# EAGLE design breakout_SX1278_green (EAGLE 8.2.0)
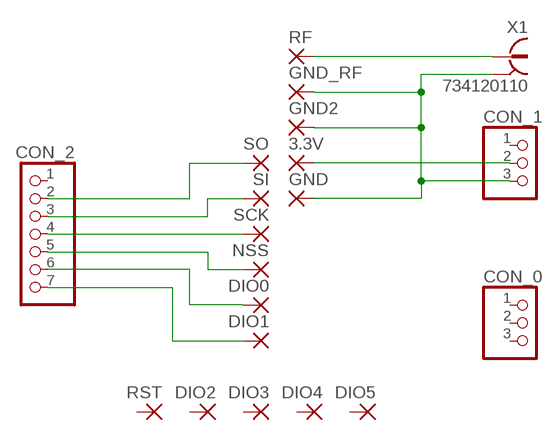
[diagram p0: schematic, sheet 1]

## Parts
3.3V  SMD2  [SMD1,27-2,54]
CON_0  PINHD-1X3  [1X03]
CON_1  PINHD-1X3  [1X03]
CON_2  PINHD-1X7  [1X07]
DIO0  SMD2  [SMD1,27-2,54]
DIO1  SMD2  [SMD1,27-2,54]
DIO2  SMD2  [SMD1,27-2,54]
DIO3  SMD2  [SMD1,27-2,54]
DIO4  SMD2  [SMD1,27-2,54]
DIO5  SMD2  [SMD1,27-2,54]
GND  SMD2  [SMD1,27-2,54]
GND2  SMD2  [SMD1,27-2,54]
GND_RF  SMD2  [SMD1,27-2,54]
NSS  SMD2  [SMD1,27-2,54]
RF  SMD2  [SMD1,27-2,54]
RST  SMD2  [SMD1,27-2,54]
SCK  SMD2  [SMD1,27-2,54]
SI  SMD2  [SMD1,27-2,54]
SO  SMD2  [SMD1,27-2,54]
X1  734120110  [734120110]

## Nets
3.3V: 3.3V.1(P) CON_1.2
ANT: RF.1(P) X1.1
DIO0: CON_2.6 DIO0.1(P)
DIO1: CON_2.7 DIO1.1(P)
GND: CON_1.3 GND2.1(P) GND.1(P) GND_RF.1(P) X1.S@1 X1.S@2 X1.S@3
MISO: CON_2.2 SO.1(P)
MOSI: CON_2.3 SI.1(P)
NSS: CON_2.5 NSS.1(P)
SCK: CON_2.4 SCK.1(P)
Unconnected: CON_0.1 CON_0.2 CON_0.3 CON_1.1 CON_2.1 DIO2.1(P) DIO3.1(P) DIO4.1(P) DIO5.1(P) RST.1(P)

## Library data of the parts
3.3V DIO0 DIO1-DIO5 GND GND2 GND_RF NSS RF RST SCK SI SO = wirepad:SMD2: SMD PAD
CON_0 CON_1 = pinhead:PINHD-1X3: PIN HEADER
CON_2 = pinhead:PINHD-1X7: PIN HEADER
X1 = con-coax:734120110: MICRO COAXIAL CONNECTOR RECEPTACLE VERTICAL Source: Data sheet <http://www.molex.com/pdm_docs/sd/734120110_sd.pdf>

## Board
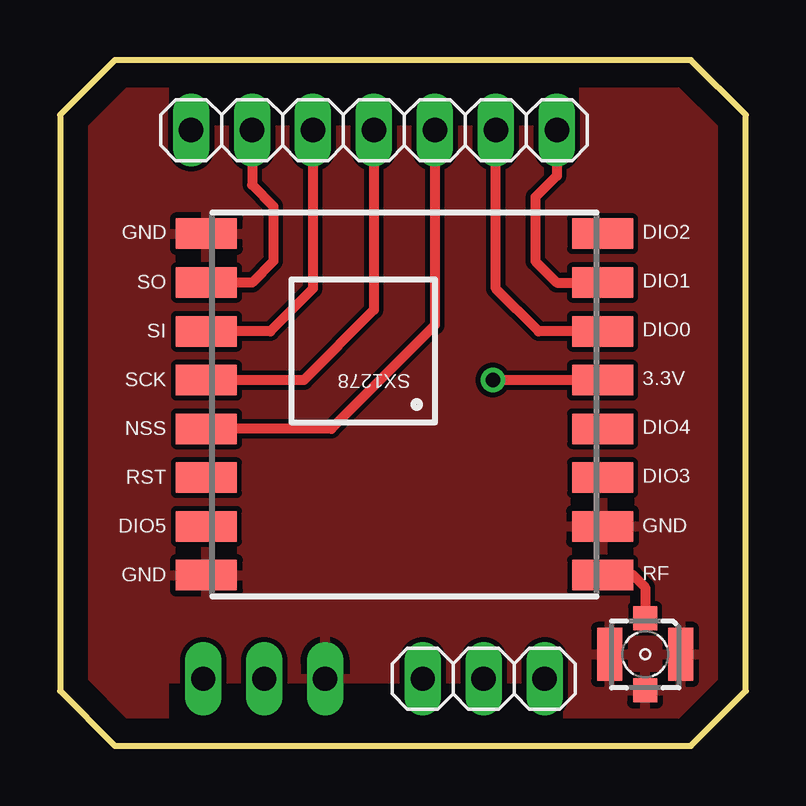
[diagram p1: board, top side]
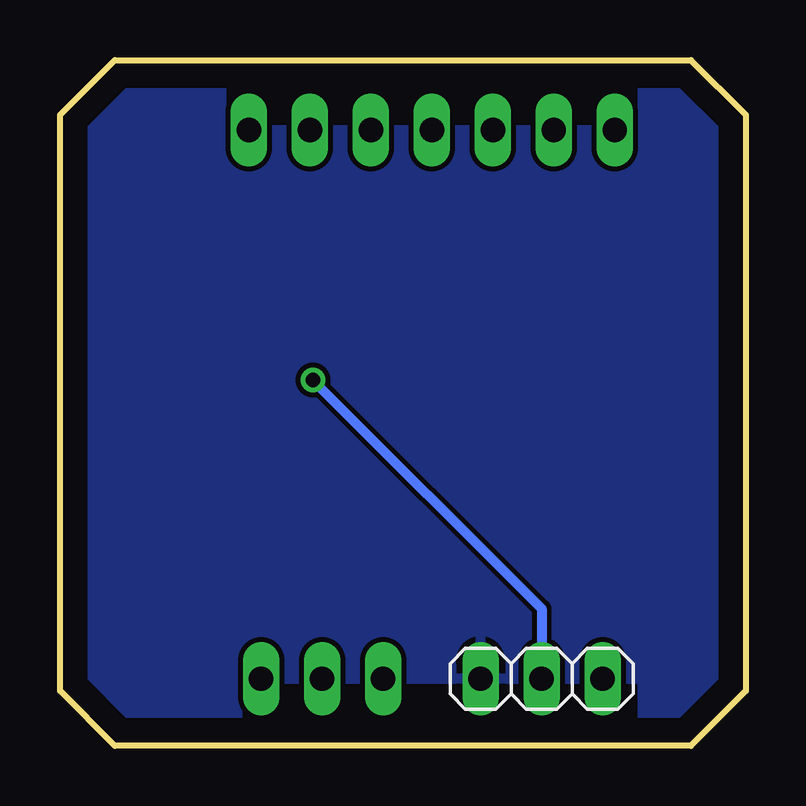
[diagram p2: board, bottom side, seen from below]

Size 28.57 x 28.57 mm. Coordinates in mm from the lower left corner, seen from the top.
Outline: 0,26.29 0,2.29 2.29,0 26.29,0 28.57,2.29 28.57,26.29 26.29,28.57 2.29,28.57 0,26.29
Copper layers (1*16): Top 0.035mm / dielectric 1.5mm / Bottom 0.035mm
Design rules "default *": minimum track width 10mil, minimum drill 0.6mm, track to track 8mil, track to pad 8mil, pad to pad 8mil, via to via 8mil, smd to smd 8mil, copper to edge 40mil, drill to drill 8mil, minimum pad ring 10mil, minimum via ring 8mil, stop-mask expansion 4mil, vias tented up to drill 0mil, thermal gap 10mil

### Footprints (pad centres in the part's own frame; a part is rotated, then mirrored left to right if it is on the bottom)
SMD1,27-2,54 = smd 1.27 x 2.54: 1 0,0
1X03 = drill 1.016 long: 1 -2.54,0; 2 0,0; 3 2.54,0
1X07 = drill 1.016 long: 1 -7.62,0; 2 -5.08,0; 3 -2.54,0; 4 0,0; 5 2.54,0; 6 5.08,0; 7 7.62,0
734120110 = smd 1 x 1: 1 0,-1.5; S@1 0,1.5 | smd 1.05 x 2.2: S@2 -1.475,0; S@3 1.475,0

### Placement (x,y rotation side)
3.3V  22.61,15.24 270 top
CON_0  17.65,2.79 180 top
CON_1  8.51,2.79 180 bottom
CON_2  13.08,25.65 0 top
DIO0  22.61,17.27 270 top
DIO1  22.61,19.3 270 top
DIO2  22.61,21.34 270 top
DIO3  22.61,11.18 270 top
DIO4  22.61,13.21 270 top
DIO5  6.1,9.14 90 top
GND  6.1,7.11 90 top
GND2  6.1,21.34 270 top
GND_RF  22.61,9.14 90 top
NSS  6.1,13.21 90 top
RF  22.61,7.11 270 top
RST  6.1,11.18 90 top
SCK  6.1,15.24 90 top
SI  6.1,17.27 90 top
SO  6.1,19.3 90 top
X1  24.38,3.81 180 top

### Tracks (layer width: path | path; a pad name or v marks a point on that pad's centre or on a via)
3.3V  (via drill 0.61)
  Top 0.406: 3.3V.1 v18.03,15.24
  Bottom 0.406: v18.03,15.24 8.51,5.71 CON_1.2
ANT
  Top 0.406: RF.1 23.88,7.11 24.38,6.6 X1.1
DIO0
  Top 0.406: DIO0.1 19.94,17.27 18.16,19.05 CON_2.6
DIO1
  Top 0.406: CON_2.7 20.7,23.75 19.81,22.86 19.81,20.19 20.7,19.3 DIO1.1
GND
  pour Top: 1.65,29.46 4.32,29.46 4.32,25.65 21.84,25.65 21.84,29.46 26.8,29.46 29.46,26.8 29.46,1.65 26.92,-0.89 19.3,-0.89 19.3,2.79 4.32,2.79 4.32,-0.89 1.78,-0.89 -0.89,1.78 -0.89,26.92
  pour Bottom: 1.91,29.08 4.32,29.08 4.32,25.65 21.84,25.65 21.84,29.08 26.54,29.08 29.08,26.54 29.08,1.91 26.67,-0.51 19.3,-0.51 19.3,2.79 4.32,2.79 4.32,-0.51 2.03,-0.51 -0.51,2.03 -0.51,26.67
MISO
  Top 0.406: CON_2.2 8,23.37 8.89,22.48 8.89,20.19 8,19.3 SO.1
MOSI
  Top 0.406: CON_2.3 10.54,19.05 8.76,17.27 SI.1
NSS
  Top 0.406: CON_2.5 15.62,17.53 11.3,13.21 NSS.1
SCK
  Top 0.406: CON_2.4 13.08,18.16 10.16,15.24 SCK.1

### Text on the board
tNames: GND | SX1278 | GND